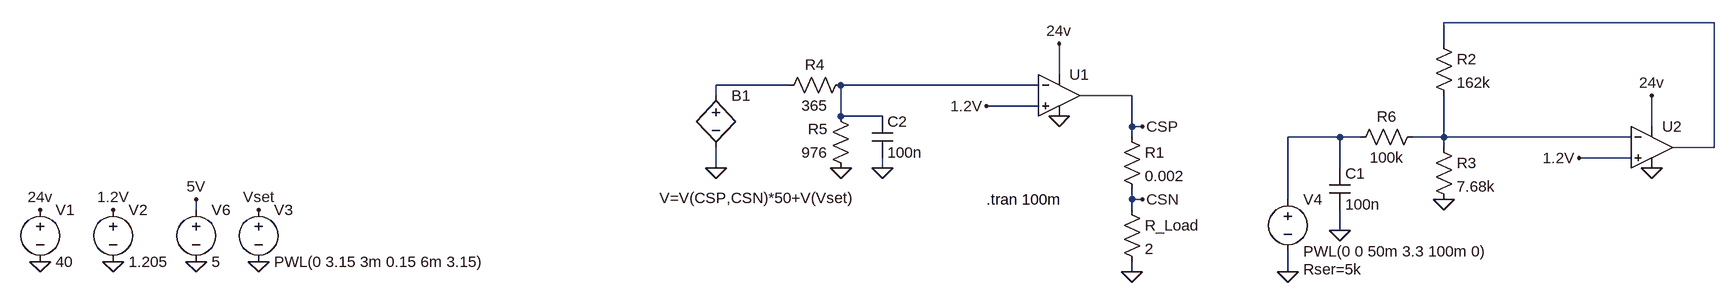
[diagram p0: schematic supercapsimplified.asc]
supercapsimplified.asc, the LTspice schematic file:
Version 4
SHEET 1 1576 680
WIRE 1216 32 800 32
WIRE 800 64 800 32
WIRE 208 112 208 64
WIRE -208 128 -320 128
WIRE 176 128 -128 128
WIRE -320 144 -320 128
WIRE 320 144 240 144
WIRE 176 160 96 160
WIRE -128 176 -128 128
WIRE -64 176 -128 176
WIRE 320 192 320 144
WIRE 336 192 320 192
WIRE 1120 192 1120 144
WIRE 320 208 320 192
WIRE 640 208 560 208
WIRE 672 208 640 208
WIRE 800 208 800 144
WIRE 800 208 752 208
WIRE 1088 208 800 208
WIRE 800 224 800 208
WIRE 1216 224 1216 32
WIRE 1216 224 1152 224
WIRE 1088 240 1008 240
WIRE -320 256 -320 224
WIRE -64 256 -64 240
WIRE 640 256 640 208
WIRE 320 304 320 288
WIRE 336 304 320 304
WIRE 560 304 560 208
WIRE -1120 320 -1120 304
WIRE 320 320 320 304
WIRE 640 352 640 320
WIRE 320 416 320 400
WIRE 560 416 560 384
FLAG 320 416 0
FLAG 208 176 0
FLAG -1248 400 0
FLAG -1248 320 1.2V
FLAG 96 160 1.2V
FLAG -1360 400 0
FLAG -1360 320 24v
FLAG 208 64 24v
FLAG -1120 400 0
FLAG -1120 304 5V
FLAG -320 256 0
FLAG -128 256 0
FLAG -64 256 0
FLAG 336 192 CSP
FLAG 336 304 CSN
FLAG -1024 400 0
FLAG -1024 320 Vset
FLAG 1120 256 0
FLAG 1008 240 1.2V
FLAG 1120 144 24v
FLAG 800 304 0
FLAG 560 416 0
FLAG 640 352 0
SYMBOL OpAmps\\UniversalOpAmp 208 144 R0
SYMATTR InstName U1
SYMBOL voltage -1248 304 R0
WINDOW 123 0 0 Left 0
WINDOW 39 0 0 Left 0
SYMATTR InstName V2
SYMATTR Value 1.205
SYMBOL voltage -1360 304 R0
WINDOW 123 0 0 Left 0
WINDOW 39 0 0 Left 0
SYMATTR InstName V1
SYMATTR Value 40
SYMBOL res 304 304 R0
SYMATTR InstName R_Load
SYMATTR Value 2
SYMBOL res 304 192 R0
SYMATTR InstName R1
SYMATTR Value 0.002
SYMBOL voltage -1120 304 R0
SYMATTR InstName V6
SYMATTR Value 5
SYMBOL res -112 112 R90
WINDOW 0 0 56 VBottom 2
WINDOW 3 32 56 VTop 2
SYMATTR InstName R4
SYMATTR Value 365
SYMBOL res -112 272 R180
WINDOW 0 36 76 Left 2
WINDOW 3 36 40 Left 2
SYMATTR InstName R5
SYMATTR Value 976
SYMBOL cap -80 176 R0
SYMATTR InstName C2
SYMATTR Value 100n
SYMBOL bv -320 128 R0
WINDOW 3 -87 174 Left 2
SYMATTR Value V=V(CSP,CSN)*50+V(Vset)
SYMATTR InstName B1
SYMBOL voltage -1024 304 R0
WINDOW 123 0 0 Left 0
WINDOW 39 0 0 Left 0
SYMATTR InstName V3
SYMATTR Value PWL(0 3.15 3m 0.15 6m 3.15)
SYMBOL OpAmps\\UniversalOpAmp 1120 224 R0
SYMATTR InstName U2
SYMBOL res 784 48 R0
SYMATTR InstName R2
SYMATTR Value 162k
SYMBOL res 784 208 R0
SYMATTR InstName R3
SYMATTR Value 7.68k
SYMBOL voltage 560 288 R0
WINDOW 123 0 0 Left 0
WINDOW 39 24 124 Left 2
SYMATTR SpiceLine Rser=5k
SYMATTR InstName V4
SYMATTR Value PWL(0 0 50m 3.3 100m 0)
SYMBOL res 768 192 R90
WINDOW 0 0 56 VBottom 2
WINDOW 3 32 56 VTop 2
SYMATTR InstName R6
SYMATTR Value 100k
SYMBOL cap 624 256 R0
SYMATTR InstName C1
SYMATTR Value 100n
TEXT 96 304 Left 2 !.tran 100m

The netlist it stands for:
* supercapsimplified.asc
XU1 1.2V N003 24v 0 CSP level1 Avol=1Meg GBW=10Meg Vos=0 En=0 Enk=0 In=0 Ink=0 Rin=500Meg  ; pins In+ In- V+ V- OUT
V2 1.2V 0 1.205
V1 24v 0 40
R_Load CSN 0 2
R1 CSP CSN 0.002
V6 5V 0 5
R4 N003 N002 365
R5 0 N003 976
C2 N003 0 100n
B1 N002 0 V=V(CSP,CSN)*50+V(Vset)
V3 Vset 0 PWL(0 3.15 3m 0.15 6m 3.15)
XU2 1.2V N005 24v 0 N001 level1 Avol=1Meg GBW=10Meg Vos=0 En=0 Enk=0 In=0 Ink=0 Rin=500Meg  ; pins In+ In- V+ V- OUT
R2 N001 N005 162k
R3 N005 0 7.68k
V4 N004 0 PWL(0 0 50m 3.3 100m 0) Rser=5k
R6 N005 N004 100k
C1 N004 0 100n
.tran 100m
.lib UniversalOpAmp1.lib
.backanno
.end